# Altium schematic sheet Sheet_2.SchDoc: R2C2 - Mini Printer Controller
size A3; DrawnBy: FMendes75@gmail.com; Revision: V0.3; SheetNumber: 2; SheetTotal: 3; =Revision: V1.1; license: Creative Commons BY-NC-SA; site: www.3dprinting-r2c2.com
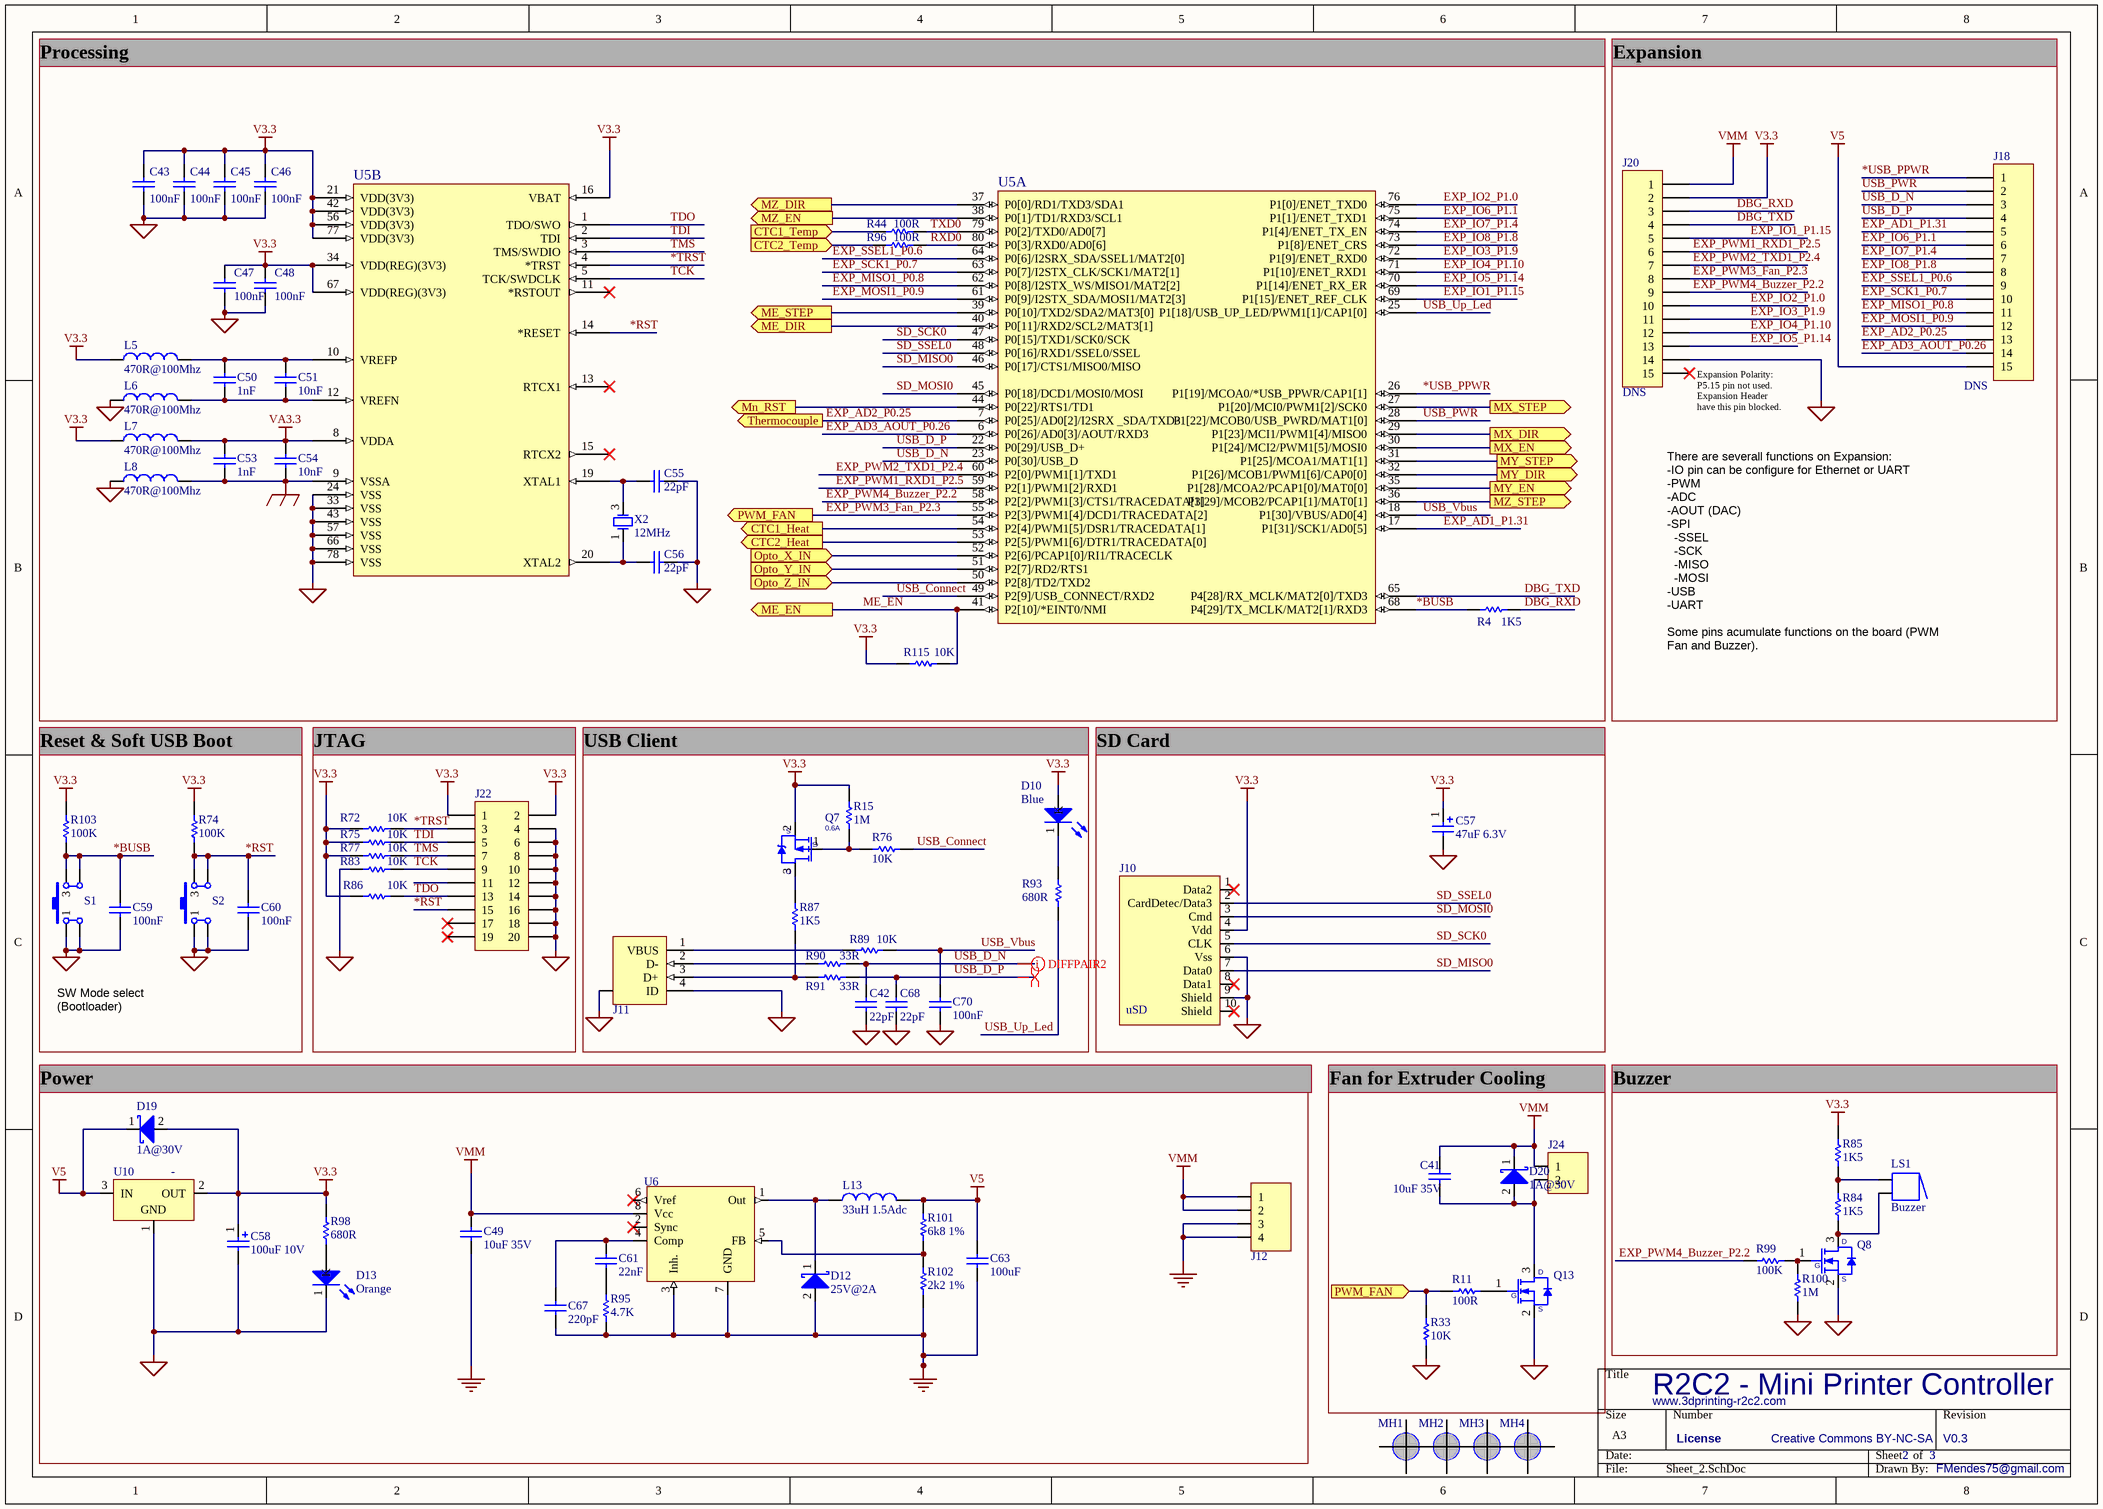
[diagram p0: Sheet_2.SchDoc]

## Parts
C41  10uF 35V  [CAPC3216M]
C42  22pF  [CAPC1608M]
C43  100nF  [CAPC1608M]
C44  100nF  [CAPC1608M]
C45  100nF  [CAPC1608M]
C46  100nF  [CAPC1608M]
C47  100nF  [CAPC1608M]
C48  100nF  [CAPC1608M]
C49  10uF 35V  [CAPC3216M]
C50  1nF  [CAPC1608M]
C51  10nF  [CAPC1608M]
C53  1nF  [CAPC1608M]
C54  10nF  [CAPC1608M]
C55  22pF  [CAPC1608M]
C56  22pF  [CAPC1608M]
C57  47uF 6.3V  [Tant_nichicon_B]
C58  100uF 10V  [CAPAE6666X54M]
C59  100nF  [CAPC1608M]
C60  100nF  [CAPC1608M]
C61  22nF  [CAPC1608M]
C63  100uF  [CAPC3216M]
C67  220pF  [CAPC1608M]
C68  22pF  [CAPC1608M]
C70  100nF  [CAPC1608M]
D10  Blue  [LEDM_3216X12M]
D12  25V@2A  [SMB]
D13  Orange  [LEDM_3216X12M]
D19  1A@30V  [SOD323]
D20  1A@30V  [SOD323]
J10  uSD  [3M_2900]
J11  micro-usb  [USB_47589-001]  (value not drawn)
J12  (no value)  [TE_SCREW_282841-4]
J18  Populate: DNS  [HDR1X15]
J20  Populate: DNS  [HDR1X15]
J22  (no value)  [HDR2X10]
J24  -  [MOLEX_22-29-2021]  (value not drawn)
L5  470R@100Mhz  [INDC1608M]
L6  470R@100Mhz  [INDC1608M]
L7  470R@100Mhz  [INDC1608M]
L8  470R@100Mhz  [INDC1608M]
L13  33uH 1.5Adc  [INDP6x6]
LS1  Buzzer  [TDK_PS1240]
MH1  -  [MH_M3]  (value not drawn)  (no BOM)
MH2  -  [MH_M3]  (value not drawn)  (no BOM)
MH3  -  [MH_M3]  (value not drawn)  (no BOM)
MH4  -  [MH_M3]  (value not drawn)  (no BOM)
Q7  0.6A  [SOT23-3M]
Q8  (no value)  [SOT323-3AM]
Q13  (no value)  [SOT323-3AM]
R4  1K5  [RESC1608M]
R11  100R  [RESC1608M]
R15  1M  [RESC1608M]
R33  10K  [RESC1608M]
R44  100R  [RESC1608M]
R72  10K  [RESC1608M]
R74  100K  [RESC1608M]
R75  10K  [RESC1608M]
R76  10K  [RESC1608M]
R77  10K  [RESC1608M]
R83  10K  [RESC1608M]
R84  1K5  [RESC1608M]
R85  1K5  [RESC1608M]
R86  10K  [RESC1608M]
R87  1K5  [RESC1608M]
R89  10K  [RESC1608M]
R90  33R  [RESC1608M]
R91  33R  [RESC1608M]
R93  680R  [RESC1608M]
R95  4.7K  [CAPC1608M]
R96  100R  [RESC1608M]
R98  680R  [RESC1608M]
R99  100K  [RESC1608M]
R100  1M  [RESC1608M]
R101  6k8 1%  [RESC1608M]
R102  2k2 1%  [RESC1608M]
R103  100K  [RESC1608M]
R115  10K  [RESC1608M]
S1  SW-PB  [SW_FSM6JSMA]  (value not drawn)
S2  SW-PB  [SW_FSM6JSMA]  (value not drawn)
U5  (no value)  [TSQFP50P1400X1400X160-80M]  (parts A,B of 2)
U6  (no value)  [SOIC127P600-8M]
U10  -  [SOT223-4M]
X2  12MHz  [txc_7b_12MHZ]

## Ports
CTC1_Heat (out), CTC1_Temp (in), CTC2_Heat (out), CTC2_Temp (in), ME_DIR (out), ME_EN (out), ME_STEP (out), Mn_RST (out), MX_DIR (out), MX_EN (out), MX_STEP (out), MY_DIR (out), MY_EN (out), MY_STEP (out), MZ_DIR (out), MZ_EN (out), MZ_STEP (out), Opto_X_IN (in), Opto_Y_IN (in), Opto_Z_IN (in), PWM_FAN (in), PWM_FAN (out), Thermocouple (out)

## Nets
GND: C42.1 C43.1 C44.1 C45.2 C46.2 C47.2 C48.2 C55.2 C56.2 C57.2 C58.2 C59.1 C60.1 C68.1 C70.1 D13.1(K) J10.6(Vss) J10.9(Shield) J11.4(ID) J11.5(SHLD) J20.14 J22.4 J22.6 J22.8 J22.10 J22.12 J22.14 J22.16 J22.18 J22.20 L6.1 L8.1 Q8.2(S) Q13.2(S) R33.1 R83.1 R100.1 S1.1 S1.2 S2.1 S2.2 U5.24(VSS) U5.33(VSS) U5.43(VSS) U5.57(VSS) U5.66(VSS) U5.78(VSS) U10.1(GND)
GND_A: C53.1 C54.1 L8.2 U5.9(VSSA)
Star_GND: C49.1 C63.1 C67.1 D12.2(A) J12.3 J12.4 R95.1 R102.1 U6.3(Inh.) U6.7(GND)
V3.3: C43.2 C44.2 C45.1 C46.1 C47.1 C48.1 C57.1 C58.1 D10.2(A) D19.2(A) J10.4(Vdd) J20.2 J22.1 J22.2 L5.1 L7.1 Q7.2(S) R15.2 R72.1 R74.2 R75.1 R77.1 R85.2 R86.1 R98.2 R103.2 R115.1 U5.16(VBAT) U5.21(VDD(3V3)) U5.34(VDD(REG)(3V3)) U5.42(VDD(3V3)) U5.56(VDD(3V3)) U5.67(VDD(REG)(3V3)) U5.77(VDD(3V3)) U10.2(OUT)
V5: C63.2 D19.1(K) J18.15 L13.2 R101.2 U10.3(IN)
VA3.3: C53.2 C54.2 L7.2 U5.8(VDDA)
VMM: C41.2 C49.2 D20.1(K) J12.1 J12.2 J20.1 J24.1 U6.8(Vcc)
*BUSB: C59.2 R4.1 R103.1 S1.3 S1.4 U5.68(P4[29]/TX_MCLK/MAT2[1]/RXD3)
*RST: C60.2 J22.15 R74.1 S2.3 S2.4 U5.14(*RESET)
*TRST: J22.3 R72.2 U5.4(*TRST)
*USB_PPWR: J18.1 U5.26(P1[19]/MCOA0/*USB_PPWR/CAP1[1])
CTC1_Heat: U5.54(P2[4]/PWM1[5]/DSR1/TRACEDATA[1]) ; port CTC1_Heat
CTC1_Temp: R44.1 ; port CTC1_Temp
CTC2_Heat: U5.53(P2[5]/PWM1[6]/DTR1/TRACEDATA[0]) ; port CTC2_Heat
CTC2_Temp: R96.1 ; port CTC2_Temp
DBG_RXD: J20.3 R4.2
DBG_TXD: J20.4 U5.65(P4[28]/RX_MCLK/MAT2[0]/TXD3)
EXP_AD1_P1.31: J18.5 U5.17(P1[31]/SCK1/AD0[5])
EXP_AD2_P0.25: J18.13 U5.7(P0[25]/AD0[2]/I2SRX__SDA/TXD3) ; port Thermocouple
EXP_AD3_AOUT_P0.26: J18.14 U5.6(P0[26]/AD0[3]/AOUT/RXD3)
EXP_IO1_P1.15: J20.5 U5.69(P1[15]/ENET_REF_CLK)
EXP_IO2_P1.0: J20.10 U5.76(P1[0]/ENET_TXD0)
EXP_IO3_P1.9: J20.11 U5.72(P1[9]/ENET_RXD0)
EXP_IO4_P1.10: J20.12 U5.71(P1[10]/ENET_RXD1)
EXP_IO5_P1.14: J20.13 U5.70(P1[14]/ENET_RX_ER)
EXP_IO6_P1.1: J18.6 U5.75(P1[1]/ENET_TXD1)
EXP_IO7_P1.4: J18.7 U5.74(P1[4]/ENET_TX_EN)
EXP_IO8_P1.8: J18.8 U5.73(P1[8]/ENET_CRS)
EXP_MISO1_P0.8: J18.11 U5.62(P0[8]/I2STX_WS/MISO1/MAT2[2])
EXP_MOSI1_P0.9: J18.12 U5.61(P0[9]/I2STX_SDA/MOSI1/MAT2[3])
EXP_PWM1_RXD1_P2.5: J20.6 U5.59(P2[1]/PWM1[2]/RXD1)
EXP_PWM2_TXD1_P2.4: J20.7 U5.60(P2[0]/PWM1[1]/TXD1)
EXP_PWM3_Fan_P2.3: J20.8 R11.1 R33.2 U5.55(P2[3]/PWM1[4]/DCD1/TRACEDATA[2]) ; port PWM_FAN
EXP_PWM4_Buzzer_P2.2: J20.9 R99.1 U5.58(P2[2]/PWM1[3]/CTS1/TRACEDATA[3])
EXP_SCK1_P0.7: J18.10 U5.63(P0[7]/I2STX_CLK/SCK1/MAT2[1])
EXP_SSEL1_P0.6: J18.9 U5.64(P0[6]/I2SRX_SDA/SSEL1/MAT2[0])
ME_DIR: U5.40(P0[11]/RXD2/SCL2/MAT3[1]) ; port ME_DIR
ME_EN: R115.2 U5.41(P2[10]/*EINT0/NMI) ; port ME_EN
ME_STEP: U5.39(P0[10]/TXD2/SDA2/MAT3[0]) ; port ME_STEP
Mn_RST: U5.44(P0[22]/RTS1/TD1) ; port Mn_RST
MX_DIR: U5.29(P1[23]/MCI1/PWM1[4]/MISO0) ; port MX_DIR
MX_EN: U5.30(P1[24]/MCI2/PWM1[5]/MOSI0) ; port MX_EN
MX_STEP: U5.27(P1[20]/MCI0/PWM1[2]/SCK0) ; port MX_STEP
MY_DIR: U5.32(P1[26]/MCOB1/PWM1[6]/CAP0[0]) ; port MY_DIR
MY_EN: U5.35(P1[28]/MCOA2/PCAP1[0]/MAT0[0]) ; port MY_EN
MY_STEP: U5.31(P1[25]/MCOA1/MAT1[1]) ; port MY_STEP
MZ_DIR: U5.37(P0[0]/RD1/TXD3/SDA1) ; port MZ_DIR
MZ_EN: U5.38(P0[1]/TD1/RXD3/SCL1) ; port MZ_EN
MZ_STEP: U5.36(P1[29]/MCOB2/PCAP1[1]/MAT0[1]) ; port MZ_STEP
Opto_X_IN: U5.52(P2[6]/PCAP1[0]/RI1/TRACECLK) ; port Opto_X_IN
Opto_Y_IN: U5.51(P2[7]/RD2/RTS1) ; port Opto_Y_IN
Opto_Z_IN: U5.50(P2[8]/TD2/TXD2) ; port Opto_Z_IN
RXD0: R96.2 U5.80(P0[3]/RXD0/AD0[6])
SD_MISO0: J10.7(Data0) U5.46(P0[17]/CTS1/MISO0/MISO)
SD_MOSI0: J10.3(Cmd) U5.45(P0[18]/DCD1/MOSI0/MOSI)
SD_SCK0: J10.5(CLK) U5.47(P0[15]/TXD1/SCK0/SCK)
SD_SSEL0: J10.2(CardDetec/Data3) U5.48(P0[16]/RXD1/SSEL0/SSEL)
TCK: J22.9 R83.2 U5.5(TCK/SWDCLK)
TDI: J22.5 R75.2 U5.2(TDI)
TDO: J22.13 R86.2 U5.1(TDO/SWO)
TMS: J22.7 R77.2 U5.3(TMS/SWDIO)
TXD0: R44.2 U5.79(P0[2]/TXD0/AD0[7])
USB_Connect: R76.2 U5.49(P2[9]/USB_CONNECT/RXD2)
USB_D_N: C42.2 J18.3 R90.2 U5.23(P0[30]/USB_D)
USB_D_P: C68.2 J18.4 R91.2 U5.22(P0[29]/USB_D+)
USB_PWR: J18.2 U5.28(P1[22]/MCOB0/USB_PWRD/MAT1[0])
USB_Up_Led: R93.1 U5.25(P1[18]/USB_UP_LED/PWM1[1]/CAP1[0])
USB_Vbus: C70.2 R89.2 U5.18(P1[30]/VBUS/AD0[4])
NetC41_1: C41.1 D20.2(A) J24.2 Q13.3(D)
NetC50_1: C50.1 C51.1 L6.2 U5.12(VREFN)
NetC50_2: C50.2 C51.2 L5.2 U5.10(VREFP)
NetC55_1: C55.1 U5.19(XTAL1) X2.3(OSC2)
NetC56_1: C56.1 U5.20(XTAL2) X2.1(OSC1)
NetC61_1: C61.1 R95.2
NetC61_2: C61.2 C67.2 U6.4(Comp)
NetD10_1: D10.1(K) R93.2
NetD12_1: D12.1(K) L13.1 U6.1(Out)
NetD13_2: D13.2(A) R98.1
NetJ11_1: J11.1(VBUS) R89.1
NetJ11_2: J11.2(D-) R90.1
NetJ11_3: J11.3(D+) R87.1 R91.1
NetLS1_1: LS1.1 R84.2 R85.1
NetLS1_2: LS1.2 Q8.3(D) R84.1
NetQ7_1: Q7.1(G) R15.1 R76.1
NetQ7_3: Q7.3(D) R87.2
NetQ8_1: Q8.1(G) R99.2 R100.2
NetQ13_1: Q13.1(G) R11.2
NetR101_1: R101.1 R102.2 U6.5(FB)

Not connected (* = marked no-connect by the designer): J10 1(Data2)* 8(Data1)* 10(Shield)*; J20 15*; J22 11 17* 19*; U5 11(*RSTOUT)* 13(RTCX1)* 15(RTCX2)*; U6 2(Sync)* 6(Vref)*

## Layout directives
differential pair: USB_D_N, USB_D_P

## Notes on the sheet
- Processing
- Expansion
- (near J20) Expansion Polarity: P5.15 pin not used.
  Expansion Header have this pin blocked.
- There are severall functions on Expansion:
  -IO pin can be configure for Ethernet or UART
  -PWM
  -ADC
  -AOUT (DAC)
  -SPI
  -SSEL
  -SCK
  -MISO
  -MOSI
  -USB
  -UART
  Some pins acumulate functions on the board (PWM Fan and Buzzer).
- Reset & Soft USB Boot
- JTAG
- USB Client
- SD Card
- SW Mode select (Bootloader)
- Power
- Fan for Extruder Cooling
- (near R85) Buzzer
- License

## Library data of the parts
C41 = 10000002: CAP CER 10UF 35V Y5V 1206; Manufacturer: Taiyo Yuden; Man PN: GMK316F106ZL-T; Pack: 1206; Component Type: Standard; Value: 10uF 35V; Digi-Key: 587-1352-1-ND
C42 C55 C56 C68 = 10000056: CAP CER 22PF 50V 5% NP0 0603; Manufacturer: TDK; Pack: 0603; Man PN: C1608C0G1H220J080AA; Component Type: Standard; Value: 22pF; Digi-Key: 445-1273-1-ND
C43-C48 C59 C60 C70 = 10000054: CAP CER 0.1UF 50V Y5V 0603; Manufacturer: Yageo; Man PN: CC0603ZRY5V9BB104; Pack: 0603; Value: 100nF; Component Type: Standard; Digi-Key: 311-1343-1-ND
C49 = 10000054: CAP CER 10UF 35V Y5V 1206; Manufacturer: Taiyo Yuden; Man PN: GMK316F106ZL-T; Pack: 1206; Component Type: Standard; Value: 10uF 35V; Digi-Key: 587-1352-1-ND
C50 C53 = 10000058: CAP CER 1000PF 50V 10% X7R 0603; Manufacturer: TDK; Pack: 0603; Man PN: CGA3E2X7R1H102K080AA; Value: 1nF; Component Type: Standard; Digi-Key: 445-5659-1-ND
C51 C54 = 10000057: CAP CER 10000PF 50V 10% X7R 0603; Manufacturer: TDK; Pack: 0603; Man PN: C1608X7R1H103K080AA; Value: 10nF; Component Type: Standard; Digi-Key: 445-1311-1-ND
C57 = 10000005: CAP TANT 47UF 6.3V 10% 1411; Manufacturer: Nichicon; Man PN: F930J476KBA; Pack: B; Component Type: Standard; Value: 47uF 6.3V; Digi-Key: 493-4122-1-ND
C58 = 10000086: CAP ALUM 100UF 16V 20% SMD; Manufacturer: Nichicon; Man PN: UWX1C101MCL1GB; Component Type: Standard; Value: 100uF 10V; Pack: -; Signal Integrity: -; Simulation: -; Digi-Key: 493-2105-1-ND
C61 = 10000066: CAP CER 0.022UF 50V 20% X7R 0603; Manufacturer: TDK; Pack: 0603; Man PN: C1608X7R1H223M080AA; Value: 22nF; Component Type: Standard; Digi-Key: 445-5092-1-ND
C63 = 10000054: CAP CER 100UF 10V 20% X5R 1206; Manufacturer: TDK; Man PN: C3216X5R1A107M160AC; Pack: 1206; Component Type: Standard; Value: 100uF; Digi-Key: 445-6007-1-ND
C67 = 10000055: CAP CER 220PF 50V 5% NP0 0603; Manufacturer: TDK; Pack: 0603; Man PN: C1608C0G1H221J080AA; Value: 220pF; Component Type: Standard; Digi-Key: 445-1285-1-ND
D10 = 10000065: LED BLUE CLEAR 1206 REV MT SMD; Manufacturer: Lite-On Inc; Man PN: LTST-C230TBKT; Pack: 1206; Value: Blue; Component Type: Standard; Digi-Key: 160-1889-1-ND
D12 = 10000009: DIODE SCHOTTKY 25V 2A SMB; Manufacturer: STMicroelectronics; Man PN: STPS2L25U; Component Type: Standard; Value: 25V@2A; Pack: SMB; Digi-Key: 497-5573-1-ND
D13 = 10000007: LED 3.2X1.6MM 601NM ORN CLR SMD; Manufacturer: OSRAM; Man PN: LYN971-Z; Pack: 1206; Value: Orange; Component Type: Standard; Digi-Key: 754-1140-1-ND
D19 D20 = 10000085: DIODE SCHOTTKY 30V 1A SOD323F; Manufacturer: NXP; Man PN: PMEG3010CEJ,115; Component Type: Standard; Value: 1A@30V; Pack: SOD323F; Signal Integrity: -; Simulation: -; Digi-Key: 568-4124-1-ND
J10 = 10000029: CONN MINI MICRO-SD 8PIN PCB GOLD; Manufacturer: Amphenol; Man PN: 101-00581-59; Value: uSD; Component Type: Standard; Digi-Key: 101-00581-59-1-ND
J11 = Con 4 USB: CONN RCPT MICRO USB AB R/A SMD; Manufacturer: Molex Inc; Man PN: 475890001; Digi-Key: WM17143CT-ND; Value: micro-usb
J12 = 10000023: Con 4; Manufacturer: TE; Man PN: 282841-4; Digi-Key: A98081-ND; Component Type: Standard
J18 J20 = 10000067: 15 SIL VERT PIN HDR; Manufacturer: Harwin Inc; Man PN: M20-9771546; Component Type: Standard; Digi-Key: 952-1856-ND
J22 = 10000064: Headers & Wire Housings 2 X 10 SHROUDED HDR; Manufacturer: Molex; Man PN: 90130-1120; Value: 2x10x2.54mm; Populate: DNS; Component Type: Standard
J24 = 10000097: CONN HEADER 2POS .100 VERT GOLD; Manufacturer: Molex; Component Type: Standard; Man PN: 22-29-2021; Value: -; Pack: -; Digi-Key: WM2744-ND
L5-L8 = 10000032: FERRITE CHIP 470 OHM 1000MA 0603; Manufacturer: MURATA; Man PN: BLM18PG471SN1D; Pack: 0603; Value: 470R@100Mhz; Component Type: Standard; Digi-Key: 490-5223-1-ND
L13 = 10000081: INDUCTOR 33UH 1.4A 20% SMD; Manufacturer: Taiyo Yuden; Man PN: NR6045T330M; Pack: 10x10x5.8; Value: 33uH 1.5Adc; Signal Integrity: -; Simulation: -; Component Type: Standard; Digi-Key: 587-2634-1-ND
LS1 = 10000068: BUZZER PIEZO 4KHZ 12.2MM PC MNT; Manufacturer: TDK; Man PN: PS1240P02BT; Pack: 1010; Component Type: Standard; Digi-Key: 445-2525-1-ND; Value: Buzzer
MH1-MH4 = 1000000: MH; Man PN: -; Manufacturer: -; Value: -; Pack: -; Component Type: Standard (No BOM)
Q7 = 10000076: MOSFET P-CH 30V 760MA SOT-23; Manufacturer: International Rectifier; Man PN: IRLML5103TRPBF; Component Type: Standard; Value: 0.6A; Pack: Sot-23; Signal Integrity: -; Simulation: -; Digi-Key: IRLML5103PBFCT-ND
Q8 Q13 = 10000039: MOSFET N-CH SGL 60V SOT-323; Manufacturer: NXP; Man PN: 2N7002PW; Pack: SOT323; Component Type: Standard; Digi-Key: 568-5987-1-ND
R4 R84 R85 R87 = 10000048: RES 1.5K OHM 1/10W 5% 0603; Manufacturer: Stackpole Electronics Inc; Man PN: RMCF0603JT1K50; Pack: 0603; Component Type: Standard; Value: 1K5; Digi-Key: RMCF0603JT1K50CT-ND
R11 R44 R96 = 10000042: RES 100 OHM 1/10W 5% 0603; Manufacturer: Stackpole Electronics Inc; Man PN: RMCF0603JT100R; Pack: 0603; Value: 100R; Component Type: Standard; Digi-Key: RMCF0603JT100RCT-ND
R15 R100 = 10000049: RES 1M OHM 1/10W 1% 0603; Manufacturer: Stackpole Electronics Inc; Man PN: RMCF0603FT1M00; Pack: 0603; Value: 1M; Component Type: Standard; Digi-Key: RMCF0603FT1M00CT-ND
R33 R72 R75-R77 R83 R86 R89 R115 = 10000044: RES 10K OHM 1/10W 5% 0603 SMD; Manufacturer: Yageo; Man PN: RC0603JR-0710KL; Pack: 0603; Value: 10K; Component Type: Standard; Digi-Key: 311-10KGRCT-ND
R74 R99 R103 = 10000045: RES 100K OHM 1/10W 5% 0603 SMD; Manufacturer: Yageo; Man PN: RC0603JR-07100KL; Pack: 0603; Value: 100K; Component Type: Standard; Digi-Key: 311-100KGRCT-ND
R90 R91 = 10000053: RES 33 OHM 1/10W 1% 0603; Manufacturer: Stackpole Electronics Inc; Man PN: RMCF0603FT33R0; Pack: 0603; Value: 33R; Component Type: Standard; Digi-Key: RMCF0603FT33R0CT-ND
R93 R98 = 10000061: RES 680 OHM 1/10W 1% 0603 SMD; Manufacturer: Panasonic; Man PN: ERJ-3EKF6800V; Pack: 0603; Value: 680R; Component Type: Standard; Digi-Key: P680HCT-ND
R95 = 10000050: 4K7; Manufacturer: Multicomp; Man PN: MC 0.063W 0603 1% 4K7; Pack: 0603; Value: 4.7K; Component Type: Standard; Digi-Key: RMCF0603FT47K0CT-ND
R101 = 10000080: RES 6.8K OHM 1/10W 1% 0603; Manufacturer: Stackpole Electronics Inc; Man PN: RMCF0603FT6K80; Pack: 0603; Value: 6k8 1%; Component Type: Standard; Digi-Key: RMCF0603FT6K80CT-ND
R102 = 10000079: RES 2.2K OHM 1/10W .1% 0603 SMD; Manufacturer: Panasonic; Man PN: ERJ-3GEYJ222V; Pack: 0603; Value: 2k2 1%; Signal Integrity: -; Simulation: -; Component Type: Standard; Digi-Key: P2.2KGCT-ND
S1 S2 = 10000019: SWITCH TACTILE SPST-NO 0.05A 12V; Manufacturer: TE Connectivity; Man PN: FSM6JSMA; Component Type: Standard; Digi-Key: 450-1133-ND; Value: SW-PB
U5 = 10000013: IC ARM CORTEX MCU 512K 80-LQFP; Manufacturer: NXP; Man PN: LPC1758FBD80,551; Pack: LQFP80; Component Type: Standard; Digi-Key: 568-4792-ND
U6 = 10000017: IC REG BUCK ADJ 1A 8SOIC; Manufacturer: STMicroelectronics; Man PN: L5970D013TR; Pack: SO-8; Value: 5.0V; Component Type: Standard; Digi-Key: 497-3636-1-ND
U10 = 10000082: IC REG LDO 3.3V 0.8A SOT223; Manufacturer: Texas Instruments; Man PN: TLV1117-33CDCYR; Pack: Sot-232; Value: 3.3V; Signal Integrity: -; Simulation: -; Component Type: Standard; Digi-Key: 296-21112-1-ND
X2 = 10000040: CRYSTAL 12.000MHZ 18PF SMD; Manufacturer: TXC CORPORATION; Man PN: 7B-12.000MAAJ-T; Value: 12MHz; Component Type: Standard; Digi-Key: 887-1099-1-ND